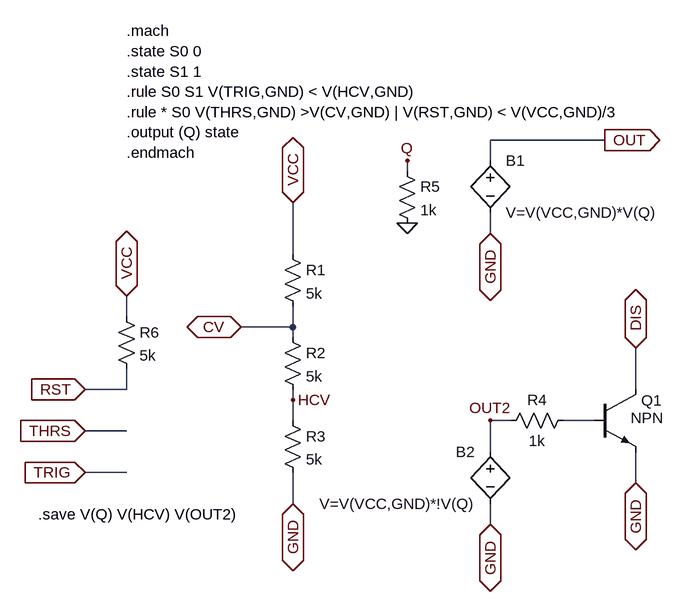
[diagram p0: schematic 555ASM.asc]
555ASM.asc, the LTspice schematic file:
Version 4
SHEET 1 1952 680
WIRE 736 -176 560 -176
WIRE 560 -144 560 -176
WIRE 432 -128 432 -144
WIRE 560 -32 560 -64
WIRE 256 0 256 -80
WIRE 0 96 0 64
WIRE 256 112 256 80
WIRE 256 112 176 112
WIRE 256 128 256 112
WIRE 0 208 0 176
WIRE 0 208 -64 208
WIRE 784 208 784 144
WIRE 256 224 256 208
WIRE 256 256 256 224
WIRE 592 256 560 256
WIRE 720 256 672 256
WIRE 0 272 -64 272
WIRE 560 304 560 256
WIRE 0 336 -64 336
WIRE 784 352 784 304
WIRE 256 384 256 336
WIRE 560 416 560 384
FLAG 176 112 CV
IOPIN 176 112 BiDir
FLAG -64 272 THRS
IOPIN -64 272 In
FLAG -64 336 TRIG
IOPIN -64 336 In
FLAG 736 -176 OUT
IOPIN 736 -176 Out
FLAG 784 144 DIS
IOPIN 784 144 BiDir
FLAG 432 -144 Q
FLAG 432 -48 0
FLAG -64 208 RST
IOPIN -64 208 In
FLAG 256 -80 VCC
IOPIN 256 -80 BiDir
FLAG 256 384 GND
IOPIN 256 384 BiDir
FLAG 0 64 VCC
IOPIN 0 64 BiDir
FLAG 560 -32 GND
IOPIN 560 -32 BiDir
FLAG 560 416 GND
IOPIN 560 416 BiDir
FLAG 784 352 GND
IOPIN 784 352 BiDir
FLAG 256 224 HCV
FLAG 560 256 OUT2
SYMBOL npn 720 208 R0
WINDOW 0 72 17 Left 2
WINDOW 3 56 44 Left 2
SYMATTR InstName Q1
SYMBOL res 576 272 R270
WINDOW 0 32 56 VTop 2
WINDOW 3 0 56 VBottom 2
SYMATTR InstName R4
SYMATTR Value 1k
SYMBOL res 416 -144 R0
SYMATTR InstName R5
SYMATTR Value 1k
SYMBOL bv 560 -160 R0
SYMATTR InstName B1
SYMATTR Value V=V(VCC,GND)*V(Q)
SYMBOL bv 560 288 M0
SYMATTR InstName B2
SYMATTR Value V=V(VCC,GND)*!V(Q)
SYMBOL res 240 -16 R0
SYMATTR InstName R1
SYMATTR Value 5k
SYMBOL res 240 112 R0
SYMATTR InstName R2
SYMATTR Value 5k
SYMBOL res 240 240 R0
SYMATTR InstName R3
SYMATTR Value 5k
SYMBOL res -16 80 R0
SYMATTR InstName R6
SYMATTR Value 5k
TEXT 0 -344 Left 2 !.mach\n.state S0 0\n.state S1 1\n.rule S0 S1 V(TRIG,GND) < V(HCV,GND)\n.rule * S0 V(THRS,GND) >V(CV,GND) | V(RST,GND) < V(VCC,GND)/3\n.output (Q) state\n.endmach
TEXT -136 400 Left 2 !.save V(Q) V(HCV) V(OUT2)

The netlist it stands for:
* 555ASM.asc
Q1 DIS N001 GND 0 NPN
R4 OUT2 N001 1k
R5 Q 0 1k
B1 OUT GND V=V(VCC,GND)*V(Q)
B2 OUT2 GND V=V(VCC,GND)*!V(Q)
R1 VCC CV 5k
R2 CV HCV 5k
R3 HCV GND 5k
R6 VCC RST 5k
.model NPN NPN
.model PNP PNP
.lib standard.bjt
.mach
.state S0 0
.state S1 1
.rule S0 S1 V(TRIG,GND) < V(HCV,GND)
.rule * S0 V(THRS,GND) >V(CV,GND) | V(RST,GND) < V(VCC,GND)/3
.output (Q) state
.endmach
.save V(Q) V(HCV) V(OUT2)
.backanno
.end